# Altium schematic sheet design_8.SchDoc: design
size 414 x 279 mm; Date: 1/25/2021 11:39:22 PM; SheetNumber: 9; Origin: Eagle; GateName_1: G$1; SymbolName_1: A3-L-GUMSTIX; LibraryName: qualified_1; DeviceSetName: A3-L-GUMSTIX; A: A; B: B; C: C; D: D; E: E; F: F; G: G; H: H; 1: 1; 2: 2; 3: 3; 4: 4; 5: 5; Sheet: Sheet:; C:/Gumstix/gumstix-logo-16.bmp: C:/Gumstix/gumstix-logo-16.bmp; Board: Board:
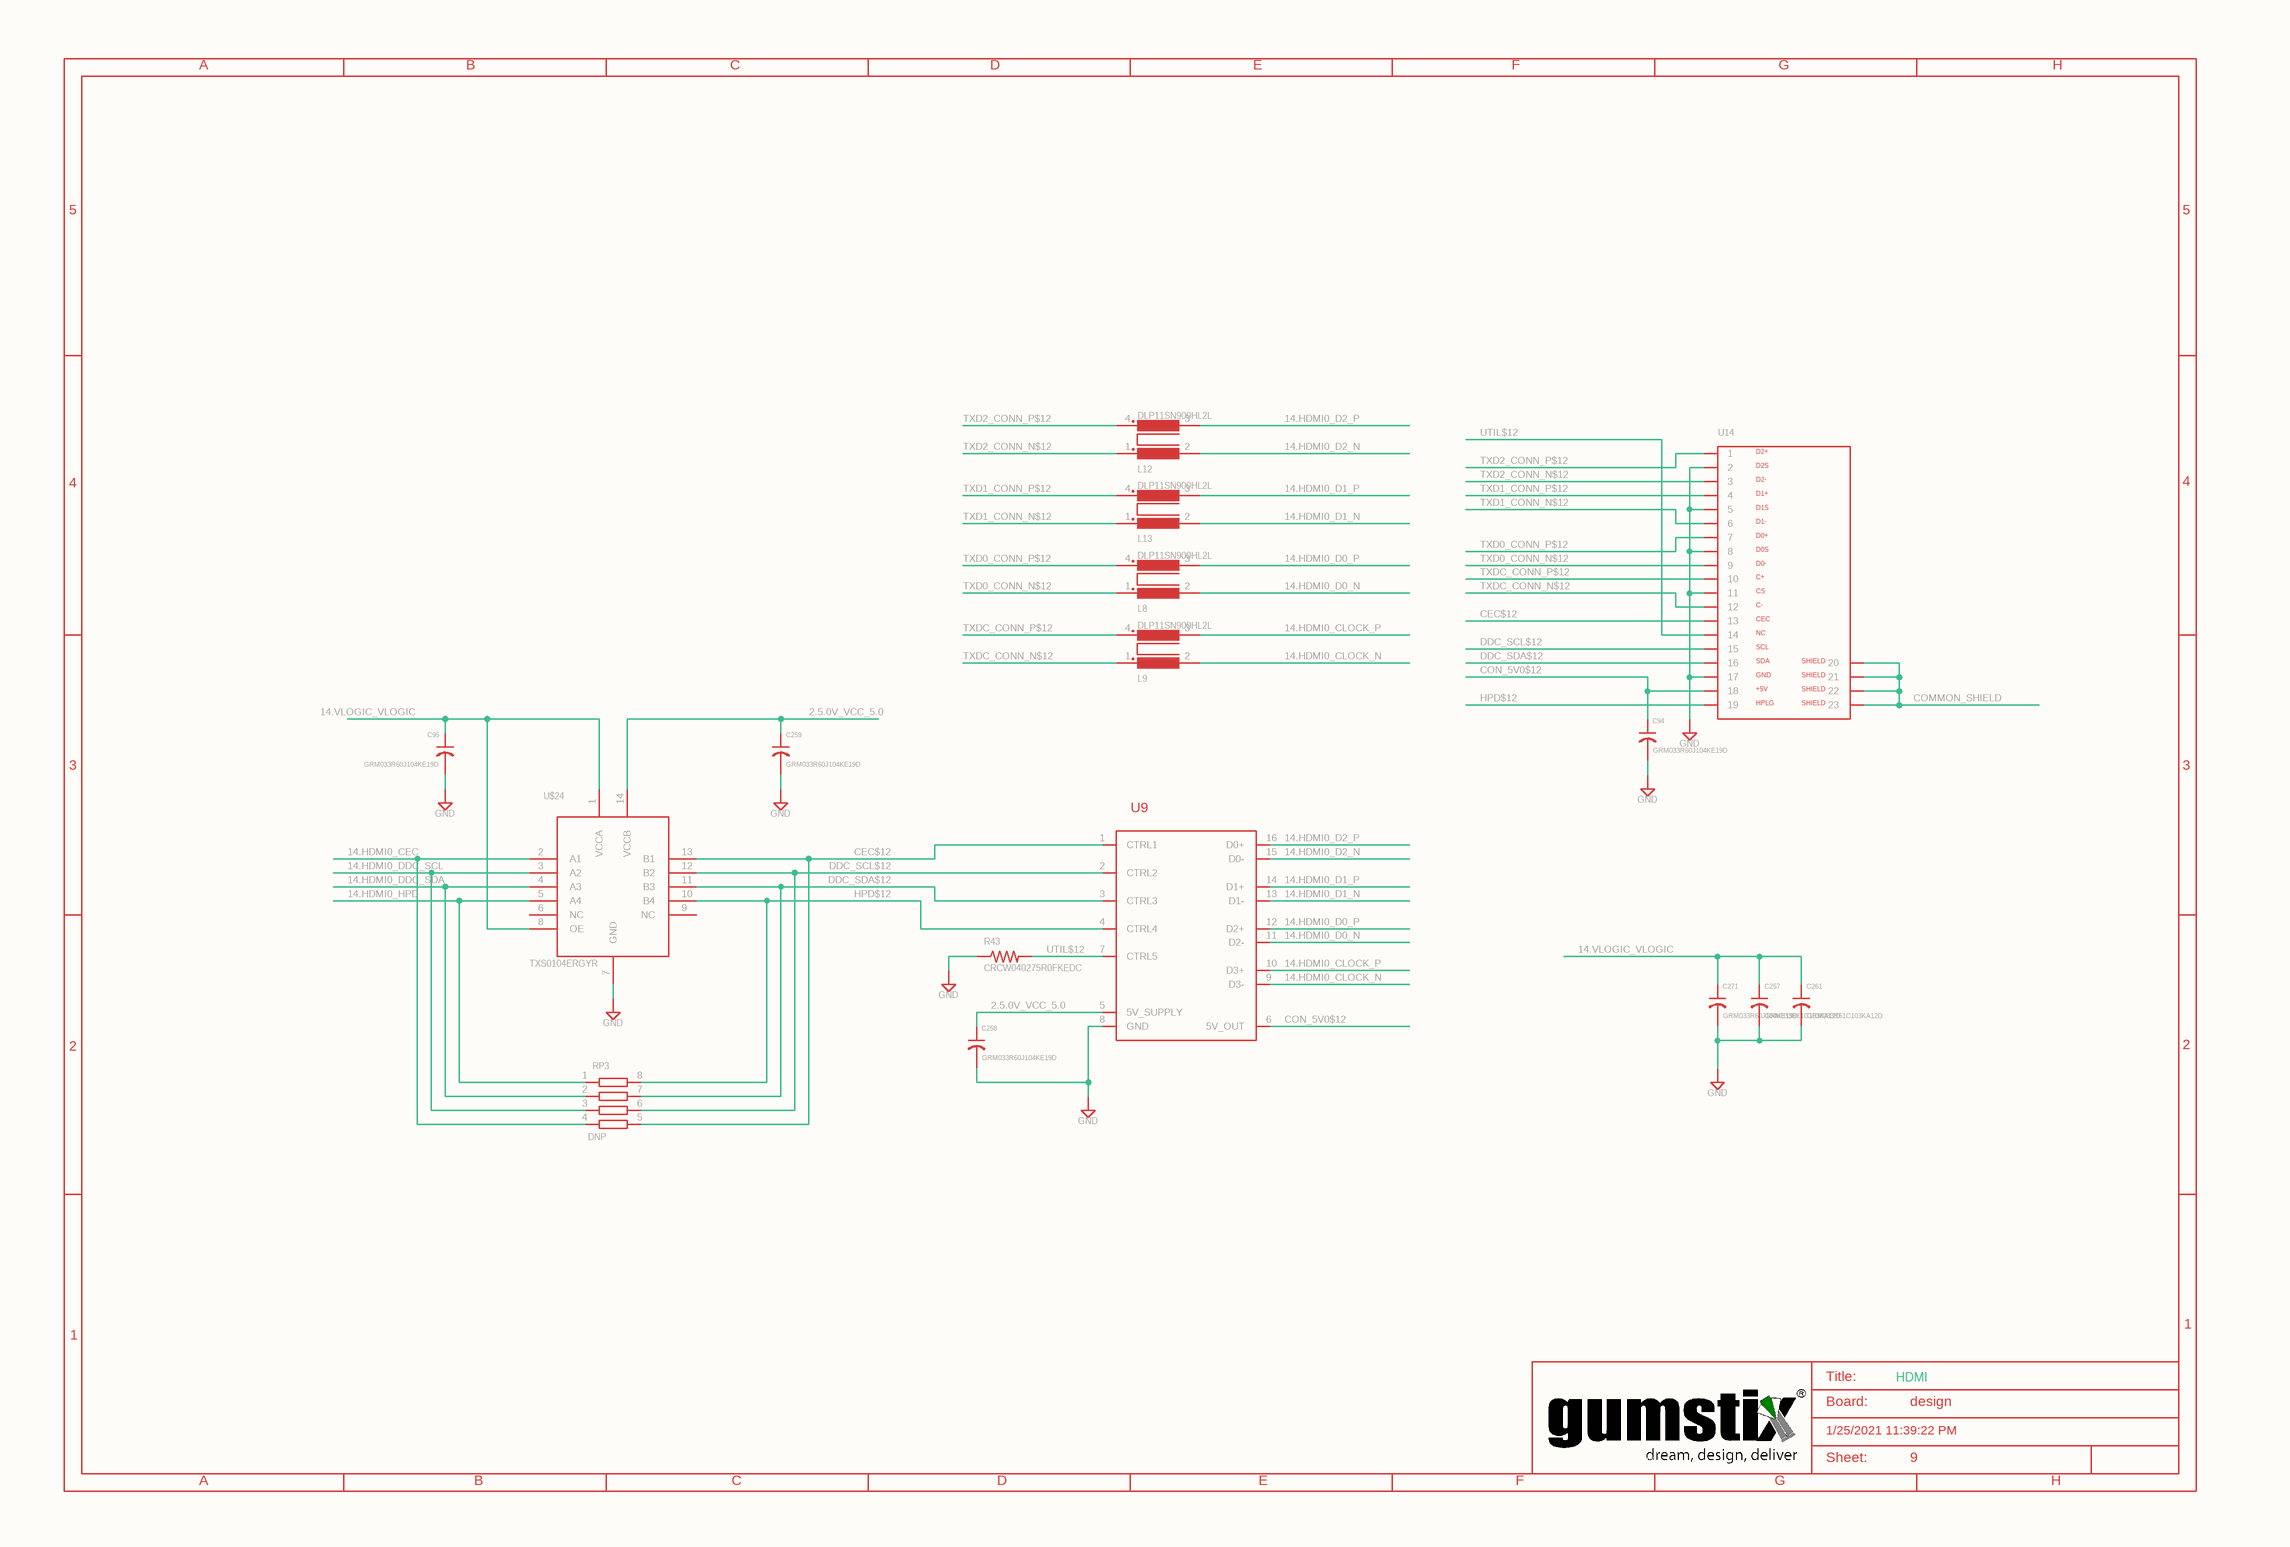
[diagram p0: design_8.SchDoc]

## Parts
C94  GRM033R60J104KE19D  [0201]
C95  GRM033R60J104KE19D  [0201]
C257  GRM033R61C103KA12D  [0201]
C258  GRM033R60J104KE19D  [0201]
C259  GRM033R60J104KE19D  [0201]
C261  GRM033R61C103KA12D  [0201]
C271  GRM033R60J104KE19D  [0201]
L8  DLP11SN900HL2L  [0504-DLP11S]
L9  DLP11SN900HL2L  [0504-DLP11S]
L12  DLP11SN900HL2L  [0504-DLP11S]
L13  DLP11SN900HL2L  [0504-DLP11S]
R43  CRCW040275R0FKEDC  [0402]
RP3  DNP  [741X08]
SUPPLY105  GND
SUPPLY106  GND
SUPPLY111  GND
SUPPLY112  GND
SUPPLY113  GND
SUPPLY114  GND
SUPPLY118  GND
SUPPLY119  GND
U9  TPD13S523PWR  [TSSOP16]  (value not drawn)
U14  685119134923  [47151-001]  (value not drawn)
U$24  TXS0104ERGYR  [S-PVQFN-N14]

## Nets
2.5.0V_VCC_5.0: C258.1 C259.1 U9.5(5V_SUPPLY) U$24.14(VCCB)
14.HDMI0_CEC: RP3.4 U$24.2(A1)
14.HDMI0_CLOCK_N: L9.2 U9.9(D3-)
14.HDMI0_CLOCK_P: L9.3 U9.10(D3+)
14.HDMI0_D0_N: L8.2 U9.11(D2-)
14.HDMI0_D0_P: L8.3 U9.12(D2+)
14.HDMI0_D1_N: L13.2 U9.13(D1-)
14.HDMI0_D1_P: L13.3 U9.14(D1+)
14.HDMI0_D2_N: L12.2 U9.15(D0-)
14.HDMI0_D2_P: L12.3 U9.16(D0+)
14.HDMI0_DDC_SCL: RP3.3 U$24.3(A2)
14.HDMI0_DDC_SDA: RP3.2 U$24.4(A3)
14.HDMI0_HPD: RP3.1 U$24.5(A4)
14.VLOGIC_VLOGIC: C95.1 C257.1 C261.1 C271.1 U$24.1(VCCA) U$24.8(OE)
CEC$12: RP3.5 U9.1(CTRL1) U14.13 U$24.13(B1)
COMMON_SHIELD: U14.G1(20) U14.G2(21) U14.G3(22) U14.G4(23)
CON_5V0$12: C94.1 U9.6(5V_OUT) U14.18
DDC_SCL$12: RP3.6 U9.2(CTRL2) U14.15 U$24.12(B2)
DDC_SDA$12: RP3.7 U9.3(CTRL3) U14.16 U$24.11(B3)
HPD$12: RP3.8 U9.4(CTRL4) U14.19 U$24.10(B4)
TXD0_CONN_N$12: L8.1 U14.9
TXD0_CONN_P$12: L8.4 U14.7
TXD1_CONN_N$12: L13.1 U14.6
TXD1_CONN_P$12: L13.4 U14.4
TXD2_CONN_N$12: L12.1 U14.3
TXD2_CONN_P$12: L12.4 U14.1
TXDC_CONN_N$12: L9.1 U14.12
TXDC_CONN_P$12: L9.4 U14.10
UTIL$12: R43.2 U9.7(CTRL5) U14.14
NetC94_2: C94.2 SUPPLY118.?1(GND)
NetC95_2: C95.2 SUPPLY112.?1(GND)
NetC257_2: C257.2 C261.2 C271.2 SUPPLY119.?1(GND)
NetC258_2: C258.2 SUPPLY106.?1(GND) U9.8(GND)
NetC259_2: C259.2 SUPPLY113.?1(GND)
NetR43_1: R43.1 SUPPLY111.?1(GND)
NetSUPPLY105_?1: SUPPLY105.?1(GND) U14.2 U14.5 U14.8 U14.11 U14.17
NetSUPPLY114_?1: SUPPLY114.?1(GND) U$24.7(GND)

Not connected (* = marked no-connect by the designer): U$24 6(NC) 9(NC)

## Notes on the sheet
- A
- B
- C
- D
- E
- F
- G
- H
- 5
- 4
- 3
- 2
- 1
- Title:
- Board:
- HDMI
- design
- C:/Gumstix/gumstix-logo-16.bmp
- 1/25/2021 11:39:22 PM
- Sheet:
- 9

## Library data of the parts
C94 C95 C258 C259 C271 = GRM033R60J104KE19D: GateName_1: G$1; SymbolName_1: C-US; LibraryName: qualified_1@eagle_src_repo_08f38ff5c3a3a6fa35c93a02bac883b74ea519d0; DeviceSetName: GRM033R60J104KE19D; HEIGHT: 0.25
  C94 C271: DM: DM; DR: DR; DX: DX; DY: DY; SHEETNO: SHEETNO
C257 C261 = GRM033R61C103KA12D: GateName_1: G$1; SymbolName_1: C-US; LibraryName: qualified_1@eagle_src_repo_08f38ff5c3a3a6fa35c93a02bac883b74ea519d0; DeviceSetName: GRM033R61C103KA12D; DM: DM; DR: DR; DX: DX; DY: DY; HEIGHT: 0.25; SHEETNO: SHEETNO
L8 L9 L12 L13 = DLP11SN900HL2L: GateName_1: G$1; SymbolName_1: COM_MODE_CHOKE_DLP; LibraryName: qualified_1; DeviceSetName: DLP11SN900HL2L; HEIGHT: 0.83
R43 = CRCW040275R0FKEDC: GateName_1: G$1; SymbolName_1: R-US; LibraryName: qualified_1@eagle_src_repo_08f38ff5c3a3a6fa35c93a02bac883b74ea519d0; DeviceSetName: CRCW040275R0FKEDC; HEIGHT: 0.35
RP3 = RP741X083741X08: GateName_1: G$1; SymbolName_1: RX04; DeviceName: 741X08; LibraryName: qualified_1; DeviceSetName: RP741X083; HEIGHT: 0.4
SUPPLY105 SUPPLY106 SUPPLY111 SUPPLY118 SUPPLY119 = GND: SUPPLY SYMBOL; GateName_1: GND; SymbolName_1: GND; LibraryName: supply2; DeviceSetName: GND
SUPPLY112-SUPPLY114 = GND: SUPPLY SYMBOL; SymbolName_1: GND-2; GateName_1: GND; LibraryName: qualified_1; DeviceSetName: GND
U9 = TPD13S523PWR: TPD13S523    13-Channel ESD Protection Solution With Current-Limit Load Switch For HDMI Transmitter Ports    http://www.ti.com/lit/ds/symlink/tpd13s523.pdf; GateName_1: G1; SymbolName_1: TPD13S523; LibraryName: qualified_1; DeviceSetName: TPD13S523PWR
U14 = 685119134923: GateName_1: G$1; SymbolName_1: HDMI; LibraryName: qualified_1; DeviceSetName: 685119134923; D2+: D2+; D2S: D2S; D2-: D2-; D1+: D1+; D1S: D1S; D1-: D1-; D0+: D0+; D0S: D0S; D0-: D0-; C+: C+; CS: CS; C-: C-; CEC: CEC; NC: NC; SCL: SCL; SDA: SDA; GND: GND; +5V: +5V; HPLG: HPLG; SHIELD: SHIELD; HEIGHT: 6.2
U$24 = TXS0104ERGYR: 4-bit Bidirectional Level Translator    http://www.ti.com/lit/ds/symlink/txs0104e.pdf; GateName_1: G$1; SymbolName_1: TXS0104E; LibraryName: qualified_1; DeviceSetName: TXS0104ERGYR